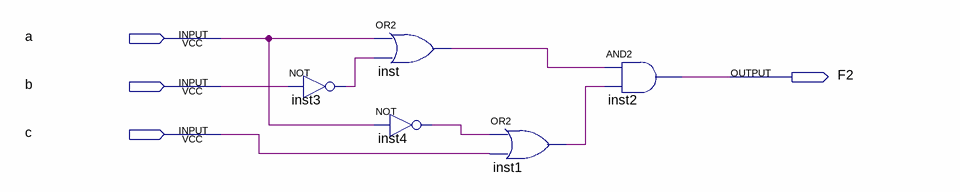
[diagram p0: schematic sheet]
// Quartus schematic Sistema02.bdf as structural Verilog: 5 symbols, 4 pins
module Sistema02 (
  input  a,
  input  b,
  input  c,
  output F2
);

  wire inst1_out, inst3_out, inst4_out, inst_out;

  not inst3 (inst3_out, b);
  or inst (inst_out, a, inst3_out);
  not inst4 (inst4_out, a);
  or inst1 (inst1_out, inst4_out, c);
  and inst2 (F2, inst_out, inst1_out);
endmodule
